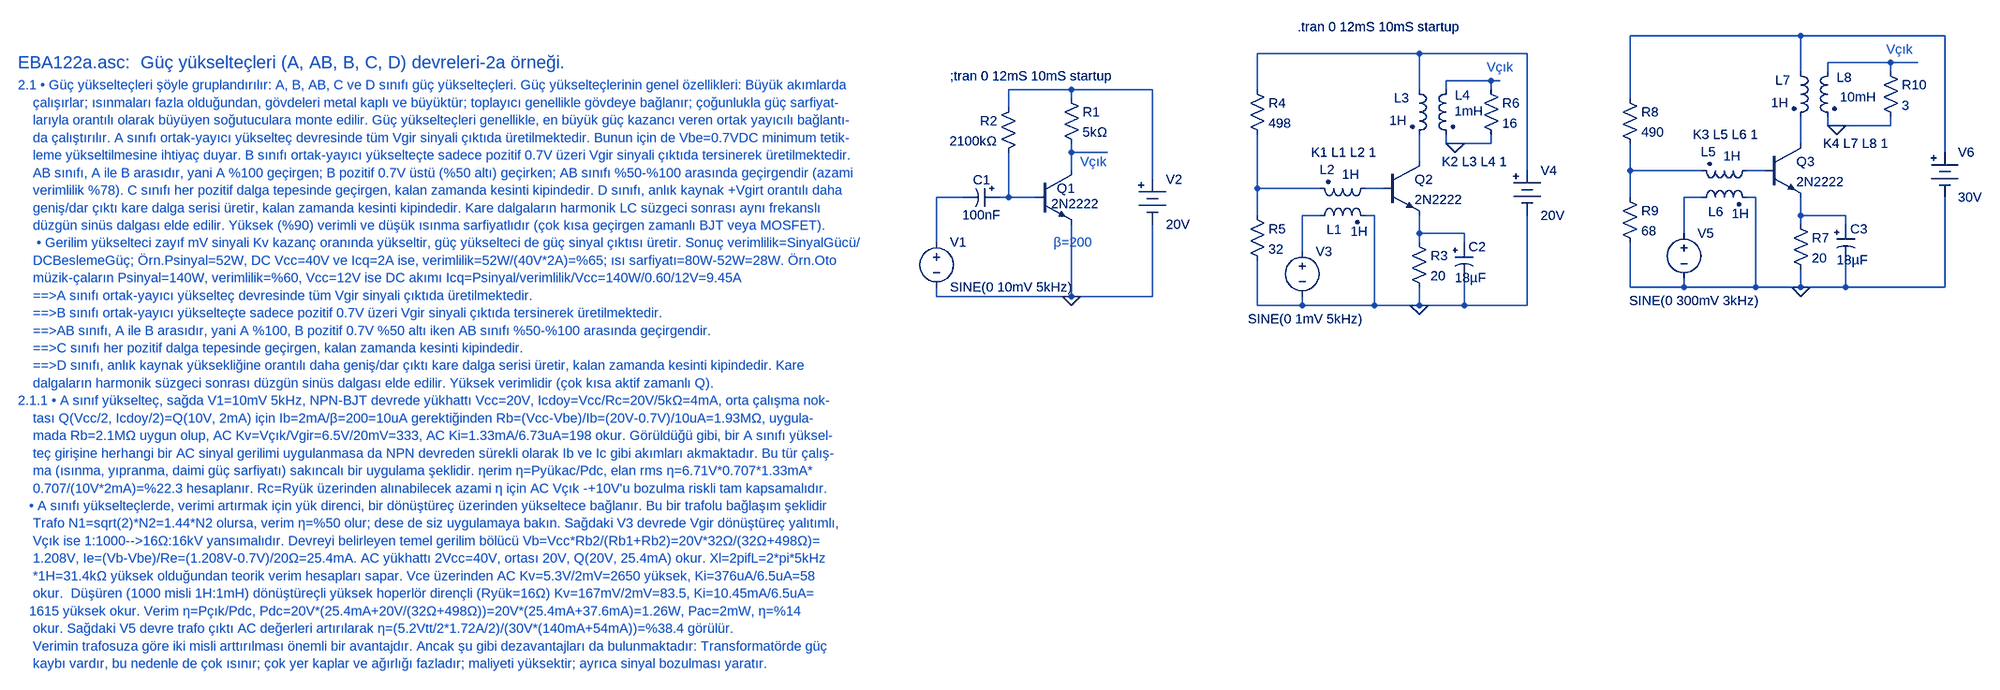
[diagram p0: schematic EBA122a.asc]
EBA122a.asc, the LTspice schematic file:
Version 4
SHEET 1 5332 4332
WIRE 3088 0 2784 0
WIRE 3344 0 3088 0
WIRE 2384 32 2096 32
WIRE 2576 32 2384 32
WIRE 3248 48 3136 48
WIRE 3296 48 3248 48
WIRE 3088 64 3088 0
WIRE 3136 64 3136 48
WIRE 3248 64 3248 48
WIRE 2512 80 2432 80
WIRE 2528 80 2512 80
WIRE 1712 96 1600 96
WIRE 1856 96 1712 96
WIRE 2096 96 2096 32
WIRE 2384 96 2384 32
WIRE 2432 96 2432 80
WIRE 2512 96 2512 80
WIRE 1712 112 1712 96
WIRE 2784 112 2784 0
WIRE 1600 128 1600 96
WIRE 3136 160 3136 144
WIRE 3152 160 3136 160
WIRE 3248 160 3248 144
WIRE 3248 160 3152 160
WIRE 2432 192 2432 176
WIRE 2448 192 2432 192
WIRE 2512 192 2512 176
WIRE 2512 192 2448 192
WIRE 3088 192 3088 144
WIRE 1712 208 1712 192
WIRE 1776 208 1712 208
WIRE 3344 208 3344 0
WIRE 2384 224 2384 176
WIRE 1712 240 1712 208
WIRE 2576 240 2576 32
WIRE 2784 240 2784 192
WIRE 2912 240 2784 240
WIRE 3024 240 2992 240
WIRE 1856 256 1856 96
WIRE 2096 272 2096 176
WIRE 2208 272 2096 272
WIRE 2320 272 2288 272
WIRE 1520 288 1472 288
WIRE 1600 288 1600 208
WIRE 1600 288 1584 288
WIRE 1648 288 1600 288
WIRE 2784 288 2784 240
WIRE 2912 288 2880 288
WIRE 3008 288 2992 288
WIRE 2096 320 2096 272
WIRE 2208 320 2176 320
WIRE 2304 320 2288 320
WIRE 3088 320 3088 288
WIRE 3168 320 3088 320
WIRE 3088 336 3088 320
WIRE 3168 336 3168 320
WIRE 2384 352 2384 320
WIRE 2464 352 2384 352
WIRE 2880 352 2880 288
WIRE 1472 368 1472 288
WIRE 2384 368 2384 352
WIRE 2464 368 2464 352
WIRE 2176 384 2176 320
WIRE 2784 448 2784 368
WIRE 2880 448 2880 432
WIRE 2880 448 2784 448
WIRE 3008 448 3008 288
WIRE 3008 448 2880 448
WIRE 3088 448 3088 416
WIRE 3088 448 3008 448
WIRE 3168 448 3168 400
WIRE 3168 448 3088 448
WIRE 3344 448 3344 288
WIRE 3344 448 3168 448
WIRE 1472 464 1472 448
WIRE 1712 464 1712 336
WIRE 1712 464 1472 464
WIRE 1856 464 1856 336
WIRE 1856 464 1712 464
WIRE 2096 480 2096 400
WIRE 2176 480 2176 464
WIRE 2176 480 2096 480
WIRE 2304 480 2304 320
WIRE 2304 480 2176 480
WIRE 2384 480 2384 448
WIRE 2384 480 2304 480
WIRE 2464 480 2464 432
WIRE 2464 480 2384 480
WIRE 2576 480 2576 320
WIRE 2576 480 2464 480
FLAG 1712 464 0
FLAG 2384 480 0
FLAG 2448 192 0
FLAG 3088 448 0
FLAG 3152 160 0
SYMBOL npn 1648 240 R0
WINDOW 0 38 32 Left 2
WINDOW 3 28 59 Left 2
SYMATTR InstName Q1
SYMATTR Value 2N2222
SYMBOL res 1696 96 R0
SYMATTR InstName R1
SYMATTR Value 5kΩ
SYMBOL res 1616 112 M0
SYMATTR InstName R2
SYMATTR Value 2100kΩ
SYMBOL polcap 1584 272 R90
WINDOW 0 0 32 VBottom 2
WINDOW 3 32 32 VTop 2
SYMATTR InstName C1
SYMATTR Value 100nF
SYMBOL voltage 1472 352 R0
WINDOW 123 0 0 Left 0
WINDOW 39 0 0 Left 0
SYMATTR InstName V1
SYMATTR Value SINE(0 10mV 5kHz)
SYMBOL Misc\\battery 1856 240 R0
SYMATTR InstName V2
SYMATTR Value 20V
SYMBOL npn 2320 224 R0
SYMATTR InstName Q2
SYMATTR Value 2N2222
SYMBOL res 2368 352 R0
SYMATTR InstName R3
SYMATTR Value 20
SYMBOL res 2080 80 R0
SYMATTR InstName R4
SYMATTR Value 498
SYMBOL res 2080 304 R0
SYMATTR InstName R5
SYMATTR Value 32
SYMBOL res 2496 80 R0
SYMATTR InstName R6
SYMATTR Value 16
SYMBOL voltage 2176 368 R0
WINDOW 3 -97 136 Left 2
WINDOW 123 0 0 Left 0
WINDOW 39 0 0 Left 0
SYMATTR Value SINE(0 1mV 5kHz)
SYMATTR InstName V3
SYMBOL Misc\\battery 2576 224 R0
SYMATTR InstName V4
SYMATTR Value 20V
SYMBOL polcap 2448 368 R0
WINDOW 3 0 63 Left 2
SYMATTR Value 18µF
SYMATTR InstName C2
SYMBOL ind2 2304 256 R90
WINDOW 0 -2 84 VBottom 2
WINDOW 3 -25 42 VTop 2
SYMATTR InstName L2
SYMATTR Value 1H
SYMATTR Type ind
SYMBOL ind2 2192 336 R270
WINDOW 0 -25 41 VTop 2
WINDOW 3 3 85 VBottom 2
SYMATTR InstName L1
SYMATTR Value 1H
SYMATTR Type ind
SYMATTR SpiceLine Rser=10
SYMBOL ind2 2368 80 R0
WINDOW 0 -29 31 Left 2
WINDOW 3 -37 71 Left 2
SYMATTR InstName L3
SYMATTR Value 1H
SYMATTR Type ind
SYMBOL ind2 2448 80 M0
WINDOW 0 -27 26 Left 2
WINDOW 3 -50 54 Left 2
SYMATTR InstName L4
SYMATTR Value 1mH
SYMATTR Type ind
SYMBOL npn 3024 192 R0
SYMATTR InstName Q3
SYMATTR Value 2N2222
SYMBOL res 3072 320 R0
SYMATTR InstName R7
SYMATTR Value 20
SYMBOL res 2768 96 R0
SYMATTR InstName R8
SYMATTR Value 490
SYMBOL res 2768 272 R0
SYMATTR InstName R9
SYMATTR Value 68
SYMBOL res 3232 48 R0
SYMATTR InstName R10
SYMATTR Value 3
SYMBOL voltage 2880 336 R0
WINDOW 3 -97 136 Left 2
WINDOW 123 0 0 Left 0
WINDOW 39 0 0 Left 0
SYMATTR Value SINE(0 300mV 3kHz)
SYMATTR InstName V5
SYMBOL Misc\\battery 3344 192 R0
SYMATTR InstName V6
SYMATTR Value 30V
SYMBOL polcap 3152 336 R0
WINDOW 3 0 63 Left 2
SYMATTR Value 18µF
SYMATTR InstName C3
SYMBOL ind2 3008 224 R90
WINDOW 0 -2 84 VBottom 2
WINDOW 3 -25 42 VTop 2
SYMATTR InstName L5
SYMATTR Value 1H
SYMATTR Type ind
SYMBOL ind2 2896 304 R270
WINDOW 0 -25 41 VTop 2
WINDOW 3 3 85 VBottom 2
SYMATTR InstName L6
SYMATTR Value 1H
SYMATTR Type ind
SYMATTR SpiceLine Rser=10
SYMBOL ind2 3072 48 R0
WINDOW 0 -29 31 Left 2
WINDOW 3 -37 71 Left 2
SYMATTR InstName L7
SYMATTR Value 1H
SYMATTR Type ind
SYMBOL ind2 3152 48 M0
WINDOW 0 -27 26 Left 2
WINDOW 3 -70 61 Left 2
SYMATTR InstName L8
SYMATTR Value 10mH
SYMATTR Type ind
TEXT -224 48 Left 3 ;EBA122a.asc:  Güç yükselteçleri (A, AB, B, C, D) devreleri-2a örneği.
TEXT -224 88 Left 2 ;2.1 • Güç yükselteçleri şöyle gruplandırılır: A, B, AB, C ve D sınıfı güç yükselteçleri. Güç yükselteçlerinin genel özellikleri: Büyük akımlarda \n    çalışırlar; ısınmaları fazla olduğundan, gövdeleri metal kaplı ve büyüktür; toplayıcı genellikle gövdeye bağlanır; çoğunlukla güç sarfiyat-\n    larıyla orantılı olarak büyüyen soğutuculara monte edilir. Güç yükselteçleri genellikle, en büyük güç kazancı veren ortak yayıcılı bağlantı-\n    da çalıştırılır. A sınıfı ortak-yayıcı yükselteç devresinde tüm Vgir sinyali çıktıda üretilmektedir. Bunun için de Vbe=0.7VDC minimum tetik-\n    leme yükseltilmesine ihtiyaç duyar. B sınıfı ortak-yayıcı yükselteçte sadece pozitif 0.7V üzeri Vgir sinyali çıktıda tersinerek üretilmektedir.\n    AB sınıfı, A ile B arasıdır, yani A %100 geçirgen; B pozitif 0.7V üstü (%50 altı) geçirken; AB sınıfı %50-%100 arasında geçirgendir (azami \n    verimlilik %78). C sınıfı her pozitif dalga tepesinde geçirgen, kalan zamanda kesinti kipindedir. D sınıfı, anlık kaynak +Vgirt orantılı daha \n    geniş/dar çıktı kare dalga serisi üretir, kalan zamanda kesinti kipindedir. Kare dalgaların harmonik LC süzgeci sonrası aynı frekanslı \n    düzgün sinüs dalgası elde edilir. Yüksek (%90) verimli ve düşük ısınma sarfiyatlıdır (çok kısa geçirgen zamanlı BJT veya MOSFET).\n     • Gerilim yükselteci zayıf mV sinyali Kv kazanç oranında yükseltir, güç yükselteci de güç sinyal çıktısı üretir. Sonuç verimlilik=SinyalGücü/\n    DCBeslemeGüç; Örn.Psinyal=52W, DC Vcc=40V ve Icq=2A ise, verimlilik=52W/(40V*2A)=%65; ısı sarfiyatı=80W-52W=28W. Örn.Oto \n    müzik-çaların Psinyal=140W, verimlilik=%60, Vcc=12V ise DC akımı Icq=Psinyal/verimlilik/Vcc=140W/0.60/12V=9.45A\n    ==>A sınıfı ortak-yayıcı yükselteç devresinde tüm Vgir sinyali çıktıda üretilmektedir.\n    ==>B sınıfı ortak-yayıcı yükselteçte sadece pozitif 0.7V üzeri Vgir sinyali çıktıda tersinerek üretilmektedir.\n    ==>AB sınıfı, A ile B arasıdır, yani A %100, B pozitif 0.7V %50 altı iken AB sınıfı %50-%100 arasında geçirgendir.\n    ==>C sınıfı her pozitif dalga tepesinde geçirgen, kalan zamanda kesinti kipindedir.\n    ==>D sınıfı, anlık kaynak yüksekliğine orantılı daha geniş/dar çıktı kare dalga serisi üretir, kalan zamanda kesinti kipindedir. Kare \n    dalgaların harmonik süzgeci sonrası düzgün sinüs dalgası elde edilir. Yüksek verimlidir (çok kısa aktif zamanlı Q).\n2.1.1 • A sınıf yükselteç, sağda V1=10mV 5kHz, NPN-BJT devrede yükhattı Vcc=20V, Icdoy=Vcc/Rc=20V/5kΩ=4mA, orta çalışma nok-\n    tası Q(Vcc/2, Icdoy/2)=Q(10V, 2mA) için Ib=2mA/β=200=10uA gerektiğinden Rb=(Vcc-Vbe)/Ib=(20V-0.7V)/10uA=1.93MΩ, uygula-\n    mada Rb=2.1MΩ uygun olup, AC Kv=Vçık/Vgir=6.5V/20mV=333, AC Ki=1.33mA/6.73uA=198 okur. Görüldüğü gibi, bir A sınıfı yüksel-\n    teç girişine herhangi bir AC sinyal gerilimi uygulanmasa da NPN devreden sürekli olarak Ib ve Ic gibi akımları akmaktadır. Bu tür çalış-\n    ma (ısınma, yıpranma, daimi güç sarfiyatı) sakıncalı bir uygulama şeklidir. ηerim η=Pyükac/Pdc, elan rms η=6.71V*0.707*1.33mA*\n    0.707/(10V*2mA)=%22.3 hesaplanır. Rc=Ryük üzerinden alınabilecek azami η için AC Vçık -+10V'u bozulma riskli tam kapsamalıdır.\n   • A sınıfı yükselteçlerde, verimi artırmak için yük direnci, bir dönüştüreç üzerinden yükseltece bağlanır. Bu bir trafolu bağlaşım şeklidir\n    Trafo N1=sqrt(2)*N2=1.44*N2 olursa, verim η=%50 olur; dese de siz uygulamaya bakın. Sağdaki V3 devrede Vgir dönüştüreç yalıtımlı,\n    Vçık ise 1:1000-->16Ω:16kV yansımalıdır. Devreyi belirleyen temel gerilim bölücü Vb=Vcc*Rb2/(Rb1+Rb2)=20V*32Ω/(32Ω+498Ω)=\n    1.208V, Ie=(Vb-Vbe)/Re=(1.208V-0.7V)/20Ω=25.4mA. AC yükhattı 2Vcc=40V, ortası 20V, Q(20V, 25.4mA) okur. Xl=2pifL=2*pi*5kHz\n    *1H=31.4kΩ yüksek olduğundan teorik verim hesapları sapar. Vce üzerinden AC Kv=5.3V/2mV=2650 yüksek, Ki=376uA/6.5uA=58\n    okur.  Düşüren (1000 misli 1H:1mH) dönüştüreçli yüksek hoperlör dirençli (Ryük=16Ω) Kv=167mV/2mV=83.5, Ki=10.45mA/6.5uA=\n   1615 yüksek okur. Verim η=Pçık/Pdc, Pdc=20V*(25.4mA+20V/(32Ω+498Ω))=20V*(25.4mA+37.6mA)=1.26W, Pac=2mW, η=%14 \n    okur. Sağdaki V5 devre trafo çıktı AC değerleri artırılarak η=(5.2Vtt/2*1.72A/2)/(30V*(140mA+54mA))=%38.4 görülür.\n    Verimin trafosuza göre iki misli arttırılması önemli bir avantajdır. Ancak şu gibi dezavantajları da bulunmaktadır: Transformatörde güç \n    kaybı vardır, bu nedenle de çok ısınır; çok yer kaplar ve ağırlığı fazladır; maliyeti yüksektir; ayrıca sinyal bozulması yaratır.
TEXT 1680 368 Left 2 ;β=200
TEXT 1728 224 Left 2 ;Vçık
TEXT 1496 72 Left 2 !;tran 0 12mS 10mS startup
TEXT 2504 56 Left 2 ;Vçık
TEXT 2192 208 Left 2 !K1 L1 L2 1
TEXT 2424 224 Left 2 !K2 L3 L4 1
TEXT 2168 -16 Left 2 !.tran 0 12mS 10mS startup
TEXT 3240 24 Left 2 ;Vçık
TEXT 2896 176 Left 2 !K3 L5 L6 1
TEXT 3128 192 Left 2 !K4 L7 L8 1

The netlist it stands for:
* EBA122a.asc
Q1 N007 N014 0 0 2N2222
R1 N005 N007 5kΩ
R2 N005 N014 2100kΩ
C1 N014 N013 100nF
V1 N013 0 SINE(0 10mV 5kHz)
V2 N005 0 20V
Q2 N008 N012 N018 0 2N2222
R3 N018 0 20
R4 N002 N011 498
R5 N011 0 32
R6 N004 0 16
V3 N016 0 SINE(0 1mV 5kHz)
V4 N002 0 20V
C2 N018 0 18µF
L2 N012 N011 1H
L1 N016 0 1H Rser=10
L3 N002 N008 1H
L4 N004 0 1mH
Q3 N006 N010 N017 0 2N2222
R7 N017 0 20
R8 N001 N009 490
R9 N009 0 68
R10 N003 0 3
V5 N015 0 SINE(0 300mV 3kHz)
V6 N001 0 30V
C3 N017 0 18µF
L5 N010 N009 1H
L6 N015 0 1H Rser=10
L7 N001 N006 1H
L8 N003 0 10mH
.model NPN NPN
.model PNP PNP
.lib standard.bjt
* EBA122a.asc:  Güç yükselteçleri (A, AB, B, C, D) devreleri-2a örneği.
* 2.1 • Güç yükselteçleri şöyle gruplandırılır: A, B, AB, C ve D sınıfı güç yükselteçleri. Güç yükselteçlerinin genel özellikleri: Büyük akımlarda
*     çalışırlar; ısınmaları fazla olduğundan, gövdeleri metal kaplı ve büyüktür; toplayıcı genellikle gövdeye bağlanır; çoğunlukla güç sarfiyat-
*     larıyla orantılı olarak büyüyen soğutuculara monte edilir. Güç yükselteçleri genellikle, en büyük güç kazancı veren ortak yayıcılı bağlantı-
*     da çalıştırılır. A sınıfı ortak-yayıcı yükselteç devresinde tüm Vgir sinyali çıktıda üretilmektedir. Bunun için de Vbe=0.7VDC minimum tetik-
*     leme yükseltilmesine ihtiyaç duyar. B sınıfı ortak-yayıcı yükselteçte sadece pozitif 0.7V üzeri Vgir sinyali çıktıda tersinerek üretilmektedir.
*     AB sınıfı, A ile B arasıdır, yani A %100 geçirgen; B pozitif 0.7V üstü (%50 altı) geçirken; AB sınıfı %50-%100 arasında geçirgendir (azami
*     verimlilik %78). C sınıfı her pozitif dalga tepesinde geçirgen, kalan zamanda kesinti kipindedir. D sınıfı, anlık kaynak +Vgirt orantılı daha
*     geniş/dar çıktı kare dalga serisi üretir, kalan zamanda kesinti kipindedir. Kare dalgaların harmonik LC süzgeci sonrası aynı frekanslı
*     düzgün sinüs dalgası elde edilir. Yüksek (%90) verimli ve düşük ısınma sarfiyatlıdır (çok kısa geçirgen zamanlı BJT veya MOSFET).
*      • Gerilim yükselteci zayıf mV sinyali Kv kazanç oranında yükseltir, güç yükselteci de güç sinyal çıktısı üretir. Sonuç verimlilik=SinyalGücü/
*     DCBeslemeGüç; Örn.Psinyal=52W, DC Vcc=40V ve Icq=2A ise, verimlilik=52W/(40V*2A)=%65; ısı sarfiyatı=80W-52W=28W. Örn.Oto
*     müzik-çaların Psinyal=140W, verimlilik=%60, Vcc=12V ise DC akımı Icq=Psinyal/verimlilik/Vcc=140W/0.60/12V=9.45A
*     ==>A sınıfı ortak-yayıcı yükselteç devresinde tüm Vgir sinyali çıktıda üretilmektedir.
*     ==>B sınıfı ortak-yayıcı yükselteçte sadece pozitif 0.7V üzeri Vgir sinyali çıktıda tersinerek üretilmektedir.
*     ==>AB sınıfı, A ile B arasıdır, yani A %100, B pozitif 0.7V %50 altı iken AB sınıfı %50-%100 arasında geçirgendir.
*     ==>C sınıfı her pozitif dalga tepesinde geçirgen, kalan zamanda kesinti kipindedir.
*     ==>D sınıfı, anlık kaynak yüksekliğine orantılı daha geniş/dar çıktı kare dalga serisi üretir, kalan zamanda kesinti kipindedir. Kare
*     dalgaların harmonik süzgeci sonrası düzgün sinüs dalgası elde edilir. Yüksek verimlidir (çok kısa aktif zamanlı Q).
* 2.1.1 • A sınıf yükselteç, sağda V1=10mV 5kHz, NPN-BJT devrede yükhattı Vcc=20V, Icdoy=Vcc/Rc=20V/5kΩ=4mA, orta çalışma nok-
*     tası Q(Vcc/2, Icdoy/2)=Q(10V, 2mA) için Ib=2mA/β=200=10uA gerektiğinden Rb=(Vcc-Vbe)/Ib=(20V-0.7V)/10uA=1.93MΩ, uygula-
*     mada Rb=2.1MΩ uygun olup, AC Kv=Vçık/Vgir=6.5V/20mV=333, AC Ki=1.33mA/6.73uA=198 okur. Görüldüğü gibi, bir A sınıfı yüksel-
*     teç girişine herhangi bir AC sinyal gerilimi uygulanmasa da NPN devreden sürekli olarak Ib ve Ic gibi akımları akmaktadır. Bu tür çalış-
*     ma (ısınma, yıpranma, daimi güç sarfiyatı) sakıncalı bir uygulama şeklidir. ηerim η=Pyükac/Pdc, elan rms η=6.71V*0.707*1.33mA*
*     0.707/(10V*2mA)=%22.3 hesaplanır. Rc=Ryük üzerinden alınabilecek azami η için AC Vçık -+10V'u bozulma riskli tam kapsamalıdır.
*    • A sınıfı yükselteçlerde, verimi artırmak için yük direnci, bir dönüştüreç üzerinden yükseltece bağlanır. Bu bir trafolu bağlaşım şeklidir
*     Trafo N1=sqrt(2)*N2=1.44*N2 olursa, verim η=%50 olur; dese de siz uygulamaya bakın. Sağdaki V3 devrede Vgir dönüştüreç yalıtımlı,
*     Vçık ise 1:1000-->16Ω:16kV yansımalıdır. Devreyi belirleyen temel gerilim bölücü Vb=Vcc*Rb2/(Rb1+Rb2)=20V*32Ω/(32Ω+498Ω)=
*     1.208V, Ie=(Vb-Vbe)/Re=(1.208V-0.7V)/20Ω=25.4mA. AC yükhattı 2Vcc=40V, ortası 20V, Q(20V, 25.4mA) okur. Xl=2pifL=2*pi*5kHz
*     *1H=31.4kΩ yüksek olduğundan teorik verim hesapları sapar. Vce üzerinden AC Kv=5.3V/2mV=2650 yüksek, Ki=376uA/6.5uA=58
*     okur.  Düşüren (1000 misli 1H:1mH) dönüştüreçli yüksek hoperlör dirençli (Ryük=16Ω) Kv=167mV/2mV=83.5, Ki=10.45mA/6.5uA=
*    1615 yüksek okur. Verim η=Pçık/Pdc, Pdc=20V*(25.4mA+20V/(32Ω+498Ω))=20V*(25.4mA+37.6mA)=1.26W, Pac=2mW, η=%14
*     okur. Sağdaki V5 devre trafo çıktı AC değerleri artırılarak η=(5.2Vtt/2*1.72A/2)/(30V*(140mA+54mA))=%38.4 görülür.
*     Verimin trafosuza göre iki misli arttırılması önemli bir avantajdır. Ancak şu gibi dezavantajları da bulunmaktadır: Transformatörde güç
*     kaybı vardır, bu nedenle de çok ısınır; çok yer kaplar ve ağırlığı fazladır; maliyeti yüksektir; ayrıca sinyal bozulması yaratır.
* β=200
* Vçık
;tran 0 12mS 10mS startup
* Vçık
K1 L1 L2 1
K2 L3 L4 1
.tran 0 12mS 10mS startup
* Vçık
K3 L5 L6 1
K4 L7 L8 1
.backanno
.end